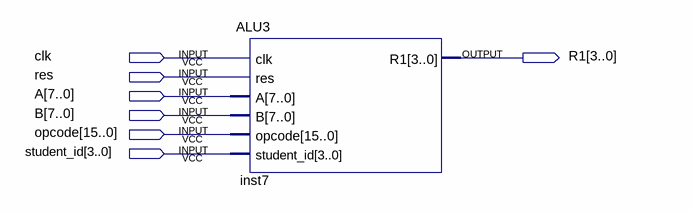
[diagram p0: schematic sheet]
// Quartus schematic ALUtest.bdf as structural Verilog: 1 symbols, 7 pins
module ALUtest (
  input  clk,
  input  res,
  input  [7:0] A,
  input  [7:0] B,
  input  [15:0] opcode,
  input  [3:0] student_id,
  output [3:0] R1
);

  ALU3 inst7 (.clk(clk), .res(res), .A(A), .B(B), .opcode(opcode), .student_id(student_id), .R1(R1));
endmodule
